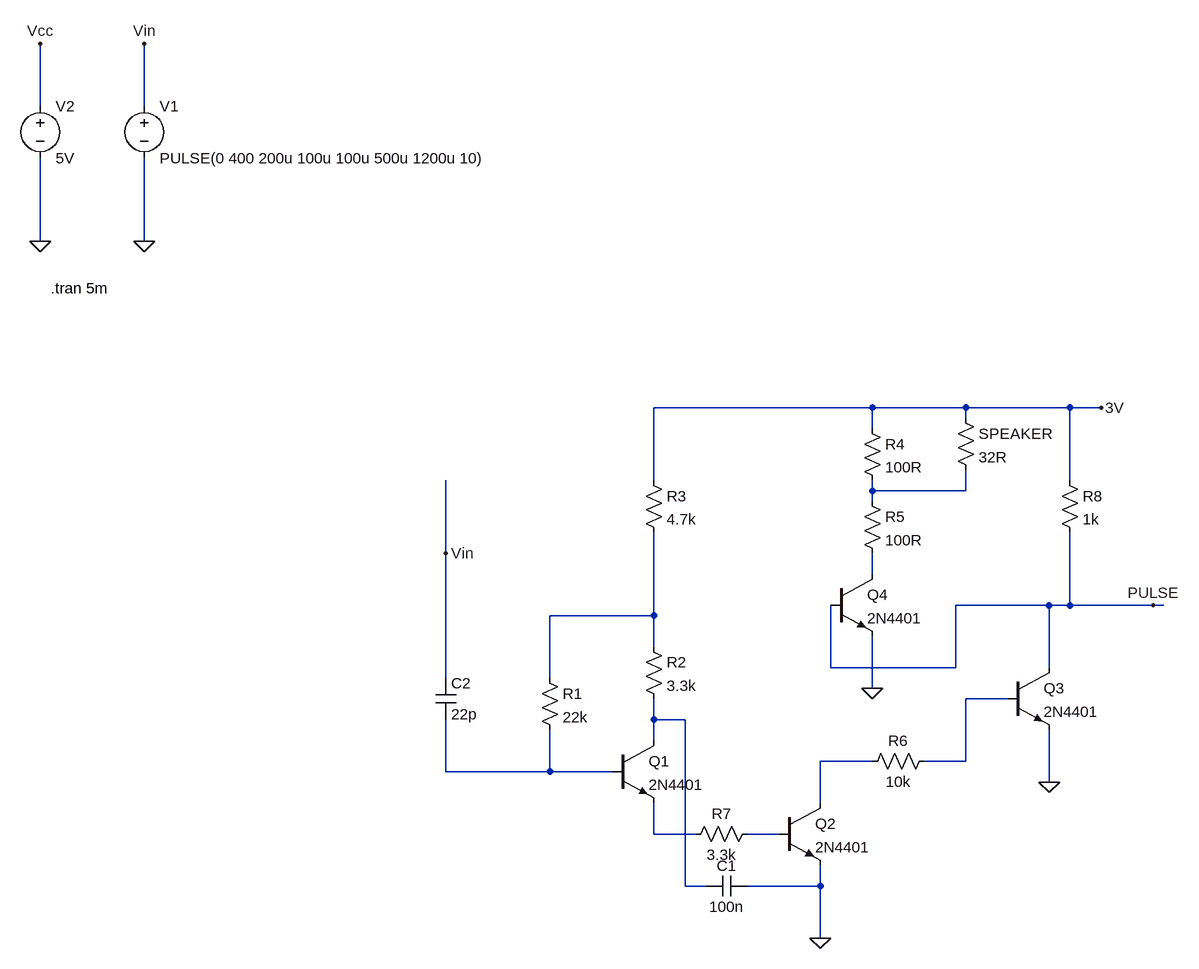
[diagram p0: schematic Draft1.asc]
Draft1.asc, the LTspice schematic file:
Version 4
SHEET 1 1176 884
WIRE -592 -416 -592 -512
WIRE -432 -416 -432 -512
WIRE -592 -208 -592 -336
WIRE -432 -208 -432 -336
WIRE 688 48 352 48
WIRE 832 48 688 48
WIRE 992 48 832 48
WIRE 1040 48 992 48
WIRE 832 64 832 48
WIRE 688 80 688 48
WIRE 352 160 352 48
WIRE 992 160 992 48
WIRE 688 176 688 160
WIRE 832 176 832 144
WIRE 832 176 688 176
WIRE 688 192 688 176
WIRE 32 272 32 160
WIRE 688 304 688 272
WIRE 960 352 816 352
WIRE 992 352 992 240
WIRE 992 352 960 352
WIRE 1120 352 992 352
WIRE 1136 352 1120 352
WIRE 352 368 352 240
WIRE 352 368 192 368
WIRE 352 416 352 368
WIRE 624 448 624 352
WIRE 816 448 816 352
WIRE 816 448 624 448
WIRE 960 448 960 352
WIRE 32 464 32 272
WIRE 192 464 192 368
WIRE 688 480 688 400
WIRE 896 496 832 496
WIRE 352 528 352 496
WIRE 400 528 352 528
WIRE 352 560 352 528
WIRE 688 592 608 592
WIRE 832 592 832 496
WIRE 832 592 768 592
WIRE 32 608 32 528
WIRE 192 608 192 544
WIRE 192 608 32 608
WIRE 288 608 192 608
WIRE 960 624 960 544
WIRE 608 656 608 592
WIRE 352 704 352 656
WIRE 416 704 352 704
WIRE 544 704 496 704
WIRE 400 784 400 528
WIRE 432 784 400 784
WIRE 608 784 608 752
WIRE 608 784 496 784
WIRE 608 864 608 784
FLAG -592 -512 Vcc
FLAG 32 272 Vin
FLAG -432 -208 0
FLAG -592 -208 0
FLAG -432 -512 Vin
FLAG 688 480 0
FLAG 960 624 0
FLAG 608 864 0
FLAG 1120 352 PULSE
FLAG 1040 48 3V
SYMBOL voltage -432 -432 R0
WINDOW 123 0 0 Left 0
WINDOW 39 0 0 Left 0
SYMATTR InstName V1
SYMATTR Value PULSE(0 400 200u 100u 100u 500u 1200u 10)
SYMBOL voltage -592 -432 R0
WINDOW 123 0 0 Left 0
WINDOW 39 0 0 Left 0
SYMATTR InstName V2
SYMATTR Value 5V
SYMBOL npn 288 560 R0
SYMATTR InstName Q1
SYMATTR Value 2N4401
SYMBOL npn 544 656 R0
SYMATTR InstName Q2
SYMATTR Value 2N4401
SYMBOL npn 896 448 R0
SYMATTR InstName Q3
SYMATTR Value 2N4401
SYMBOL npn 624 304 R0
SYMATTR InstName Q4
SYMATTR Value 2N4401
SYMBOL res 176 448 R0
SYMATTR InstName R1
SYMATTR Value 22k
SYMBOL res 336 400 R0
SYMATTR InstName R2
SYMATTR Value 3.3k
SYMBOL res 336 144 R0
SYMATTR InstName R3
SYMATTR Value 4.7k
SYMBOL res 672 64 R0
SYMATTR InstName R4
SYMATTR Value 100R
SYMBOL res 672 176 R0
SYMATTR InstName R5
SYMATTR Value 100R
SYMBOL res 816 48 R0
SYMATTR InstName SPEAKER
SYMATTR Value 32R
SYMBOL res 784 576 R90
WINDOW 0 0 56 VBottom 2
WINDOW 3 32 56 VTop 2
SYMATTR InstName R6
SYMATTR Value 10k
SYMBOL res 512 688 R90
WINDOW 0 0 56 VBottom 2
WINDOW 3 32 56 VTop 2
SYMATTR InstName R7
SYMATTR Value 3.3k
SYMBOL cap 496 768 R90
WINDOW 0 0 32 VBottom 2
WINDOW 3 32 32 VTop 2
SYMATTR InstName C1
SYMATTR Value 100n
SYMBOL res 976 144 R0
SYMATTR InstName R8
SYMATTR Value 1k
SYMBOL cap 16 464 R0
SYMATTR InstName C2
SYMATTR Value 22p
TEXT -576 -136 Left 2 !.tran 5m

The netlist it stands for:
* Draft1.asc
V1 Vin 0 PULSE(0 400 200u 100u 100u 500u 1200u 10)
V2 Vcc 0 5V
Q1 N005 N007 N008 0 2N4401
Q2 N006 N009 0 0 2N4401
Q3 PULSE N004 0 0 2N4401
Q4 N002 PULSE 0 0 2N4401
R1 N003 N007 22k
R2 N003 N005 3.3k
R3 3V N003 4.7k
R4 3V N001 100R
R5 N001 N002 100R
R§SPEAKER 3V N001 32R
R6 N004 N006 10k
R7 N009 N008 3.3k
C1 0 N005 100n
R8 3V PULSE 1k
C2 Vin N007 22p
.model NPN NPN
.model PNP PNP
.lib standard.bjt
.tran 5m
.backanno
.end